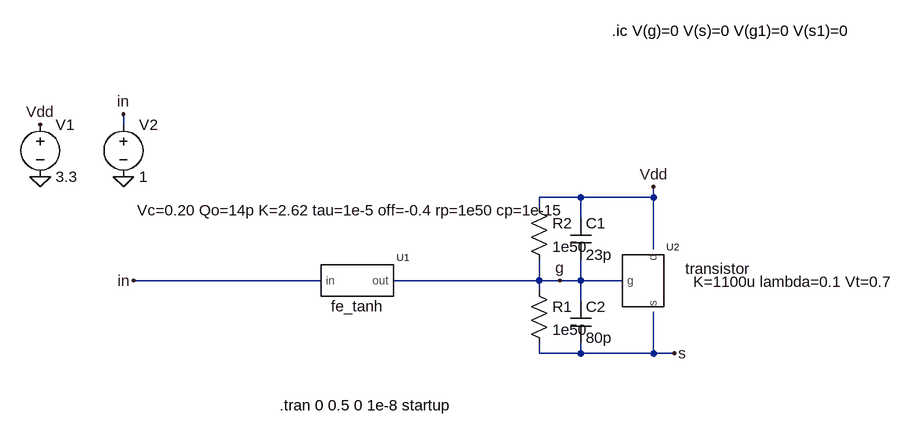
[diagram p0: schematic Oscilador.asc]
Oscilador.asc, the LTspice schematic file:
Version 4
SHEET 1 2244 680
WIRE -128 -48 -128 -64
WIRE 576 64 512 64
WIRE 688 64 688 48
WIRE 688 64 576 64
WIRE 512 80 512 64
WIRE 576 96 576 64
WIRE 688 144 688 64
WIRE 176 192 -112 192
WIRE 512 192 512 160
WIRE 512 192 288 192
WIRE 544 192 512 192
WIRE 576 192 576 160
WIRE 576 192 544 192
WIRE 640 192 576 192
WIRE 512 208 512 192
WIRE 576 224 576 192
WIRE 512 304 512 288
WIRE 576 304 576 288
WIRE 576 304 512 304
WIRE 688 304 688 240
WIRE 688 304 576 304
WIRE 720 304 688 304
FLAG -256 32 0
FLAG -256 -48 Vdd
FLAG 688 48 Vdd
FLAG -128 32 0
FLAG -112 192 in
FLAG -128 -64 in
FLAG 544 192 g
FLAG 720 304 s
SYMBOL voltage -256 -64 R0
WINDOW 123 0 0 Left 0
WINDOW 39 0 0 Left 0
SYMATTR InstName V1
SYMATTR Value 3.3
SYMBOL cap 560 96 R0
SYMATTR InstName C1
SYMATTR Value 23p
SYMBOL cap 560 224 R0
SYMATTR InstName C2
SYMATTR Value 80p
SYMBOL res 496 192 R0
SYMATTR InstName R1
SYMATTR Value 1e50
SYMBOL res 496 64 R0
SYMATTR InstName R2
SYMATTR Value 1e50
SYMBOL voltage -128 -64 R0
WINDOW 123 0 0 Left 0
WINDOW 39 0 0 Left 0
SYMATTR InstName V2
SYMATTR Value 1
SYMBOL fe_tanh 224 192 R0
SYMATTR SpiceLine Vc=0.20 Qo=14p K=2.62 tau=1e-5 off=-0.4 rp=1e50 cp=1e-15
SYMATTR InstName U1
SYMBOL transistor 672 192 R0
SYMATTR InstName U2
TEXT 624 -192 Left 2 !.ic V(g)=0 V(s)=0 V(g1)=0 V(s1)=0
TEXT 112 384 Left 2 !.tran 0 0.5 0 1e-8 startup

The netlist it stands for:
* Oscilador.asc
V1 Vdd 0 3.3
C1 Vdd g 23p
C2 g s 80p
R1 g s 1e50
R2 Vdd g 1e50
V2 in 0 1
XU1 in g fe_tanh Vc=0.20 Qo=14p K=2.62 tau=1e-5 off=-0.4 rp=1e50 cp=1e-15  ; pins in out
XU2 g Vdd s transistor K=1100u lambda=0.1 Vt=0.7  ; pins g d s
.ic V(g)=0 V(s)=0 V(g1)=0 V(s1)=0
.tran 0 0.5 0 1e-8 startup
.lib C:\Users\MBX\Desktop\Investigacion\Spice-LK-Model\Fe_model\fe_tanh_ni.sp
.lib C:\Users\MBX\Desktop\Investigacion\Spice-LK-Model\Oscilador_test\transistor.sp
.backanno
.end